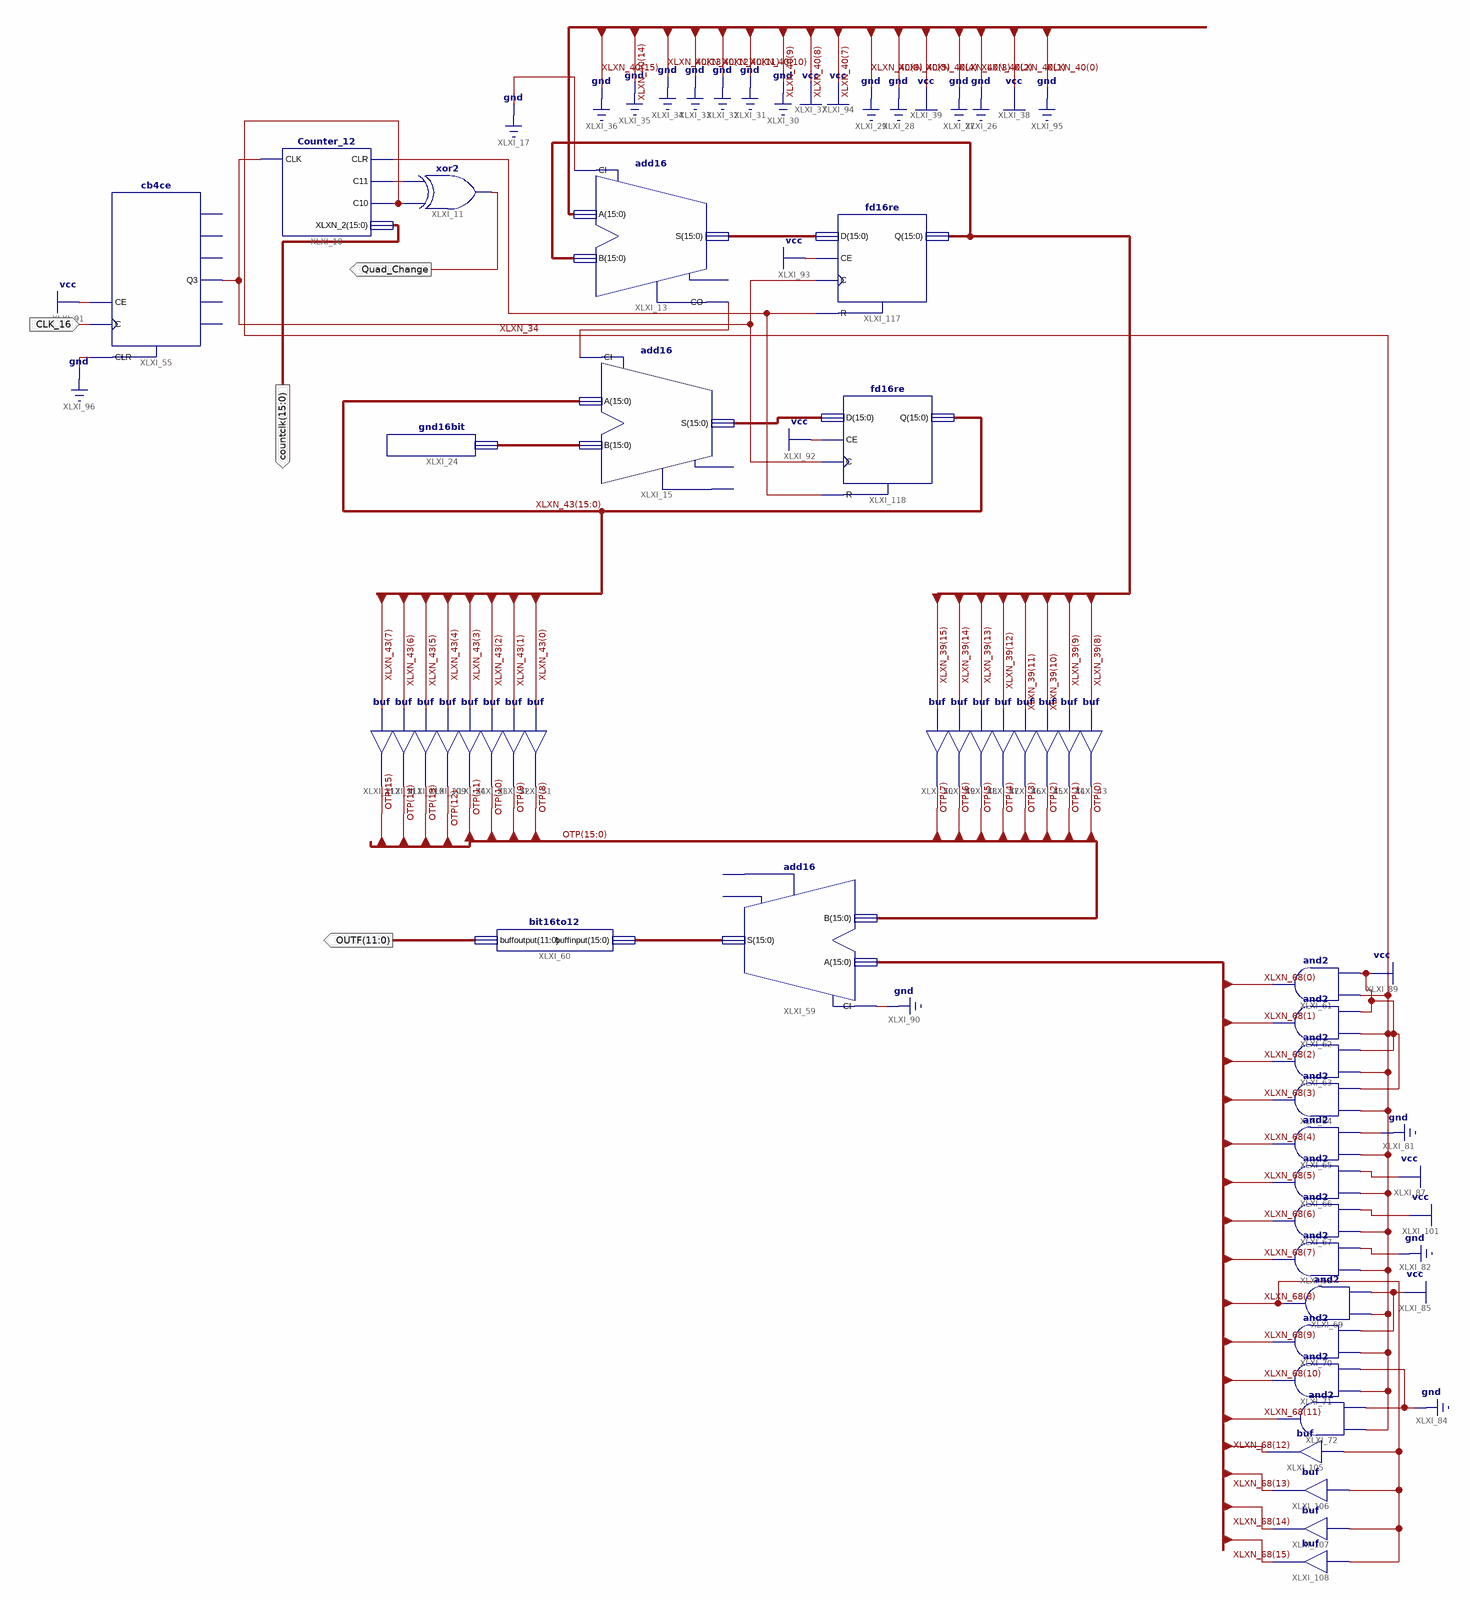
[diagram p0: schematic sheet 1]
// Xilinx ISE schematic anglecounter.sch (spartan3) as structural Verilog: 42 symbols, 4 ports
module anglecounter (
  input  CLK_16,
  output Quad_Change,
  output [11:0] OUTF,
  output [15:0] countclk
);

  wire XLXN_34, XLXN_35, XLXN_36, XLXN_44, XLXN_112;
  wire [15:0] OTP, XLXN_37, XLXN_39, XLXN_42, XLXN_43, XLXN_47, XLXN_68, XLXN_69;

  Counter_12 XLXI_10 (.CLK(XLXN_36), .XLXN_2(countclk), .CLR(XLXN_112), .C11(XLXN_35), .C10(XLXN_34));
  xor XLXI_11 (Quad_Change, XLXN_34, XLXN_35);
  add16 XLXI_13 (.A(16'b0000000110010010), .B(XLXN_39), .CI(1'b0), .CO(XLXN_44), .S(XLXN_37));  // open: OFL
  add16 XLXI_15 (.A(XLXN_43), .B(XLXN_47), .CI(XLXN_44), .S(XLXN_42));  // open: CO, OFL
  gnd16bit XLXI_24 (.x_constant(XLXN_47));
  buf XLXI_43 (OTP[0], XLXN_39[8]);
  buf XLXI_44 (OTP[1], XLXN_39[9]);
  buf XLXI_45 (OTP[2], XLXN_39[10]);
  buf XLXI_46 (OTP[3], XLXN_39[11]);
  buf XLXI_47 (OTP[4], XLXN_39[12]);
  buf XLXI_48 (OTP[5], XLXN_39[13]);
  buf XLXI_49 (OTP[6], XLXN_39[14]);
  buf XLXI_50 (OTP[7], XLXN_39[15]);
  buf XLXI_51 (OTP[8], XLXN_43[0]);
  buf XLXI_52 (OTP[9], XLXN_43[1]);
  buf XLXI_53 (OTP[10], XLXN_43[2]);
  buf XLXI_54 (OTP[11], XLXN_43[3]);
  cb4ce XLXI_55 (.C(CLK_16), .CE(1'b1), .CLR(1'b0), .Q3(XLXN_36));  // open: CEO, Q0, Q1, Q2, TC
  add16 XLXI_59 (.A(XLXN_68), .B(OTP), .CI(1'b0), .S(XLXN_69));  // open: CO, OFL
  bit16to12 XLXI_60 (.buffinput(XLXN_69), .buffoutput(OUTF));
  and XLXI_61 (XLXN_68[0], 1'b1, XLXN_34);
  and XLXI_62 (XLXN_68[1], 1'b1, XLXN_34);
  and XLXI_63 (XLXN_68[2], 1'b1, XLXN_34);
  and XLXI_64 (XLXN_68[3], 1'b1, XLXN_34);
  and XLXI_65 (XLXN_68[4], 1'b0, XLXN_34);
  and XLXI_66 (XLXN_68[5], 1'b1, XLXN_34);
  and XLXI_67 (XLXN_68[6], 1'b1, XLXN_34);
  and XLXI_68 (XLXN_68[7], 1'b0, XLXN_34);
  and XLXI_69 (XLXN_68[8], 1'b1, XLXN_34);
  and XLXI_70 (XLXN_68[9], 1'b1, XLXN_34);
  and XLXI_71 (XLXN_68[10], 1'b0, XLXN_34);
  and XLXI_72 (XLXN_68[11], 1'b0, XLXN_34);
  buf XLXI_105 (XLXN_68[12], XLXN_68[8]);
  buf XLXI_106 (XLXN_68[13], XLXN_68[8]);
  buf XLXI_107 (XLXN_68[14], XLXN_68[8]);
  buf XLXI_108 (XLXN_68[15], XLXN_68[8]);
  buf XLXI_109 (OTP[12], XLXN_43[4]);
  buf XLXI_110 (OTP[13], XLXN_43[5]);
  buf XLXI_111 (OTP[14], XLXN_43[6]);
  buf XLXI_112 (OTP[15], XLXN_43[7]);
  fd16re XLXI_117 (.C(XLXN_36), .CE(1'b1), .D(XLXN_37), .R(XLXN_112), .Q(XLXN_39));
  fd16re XLXI_118 (.C(XLXN_36), .CE(1'b1), .D(XLXN_42), .R(XLXN_112), .Q(XLXN_43));
endmodule
